# EAGLE schematic receiving end(2) (EAGLE 6.3)
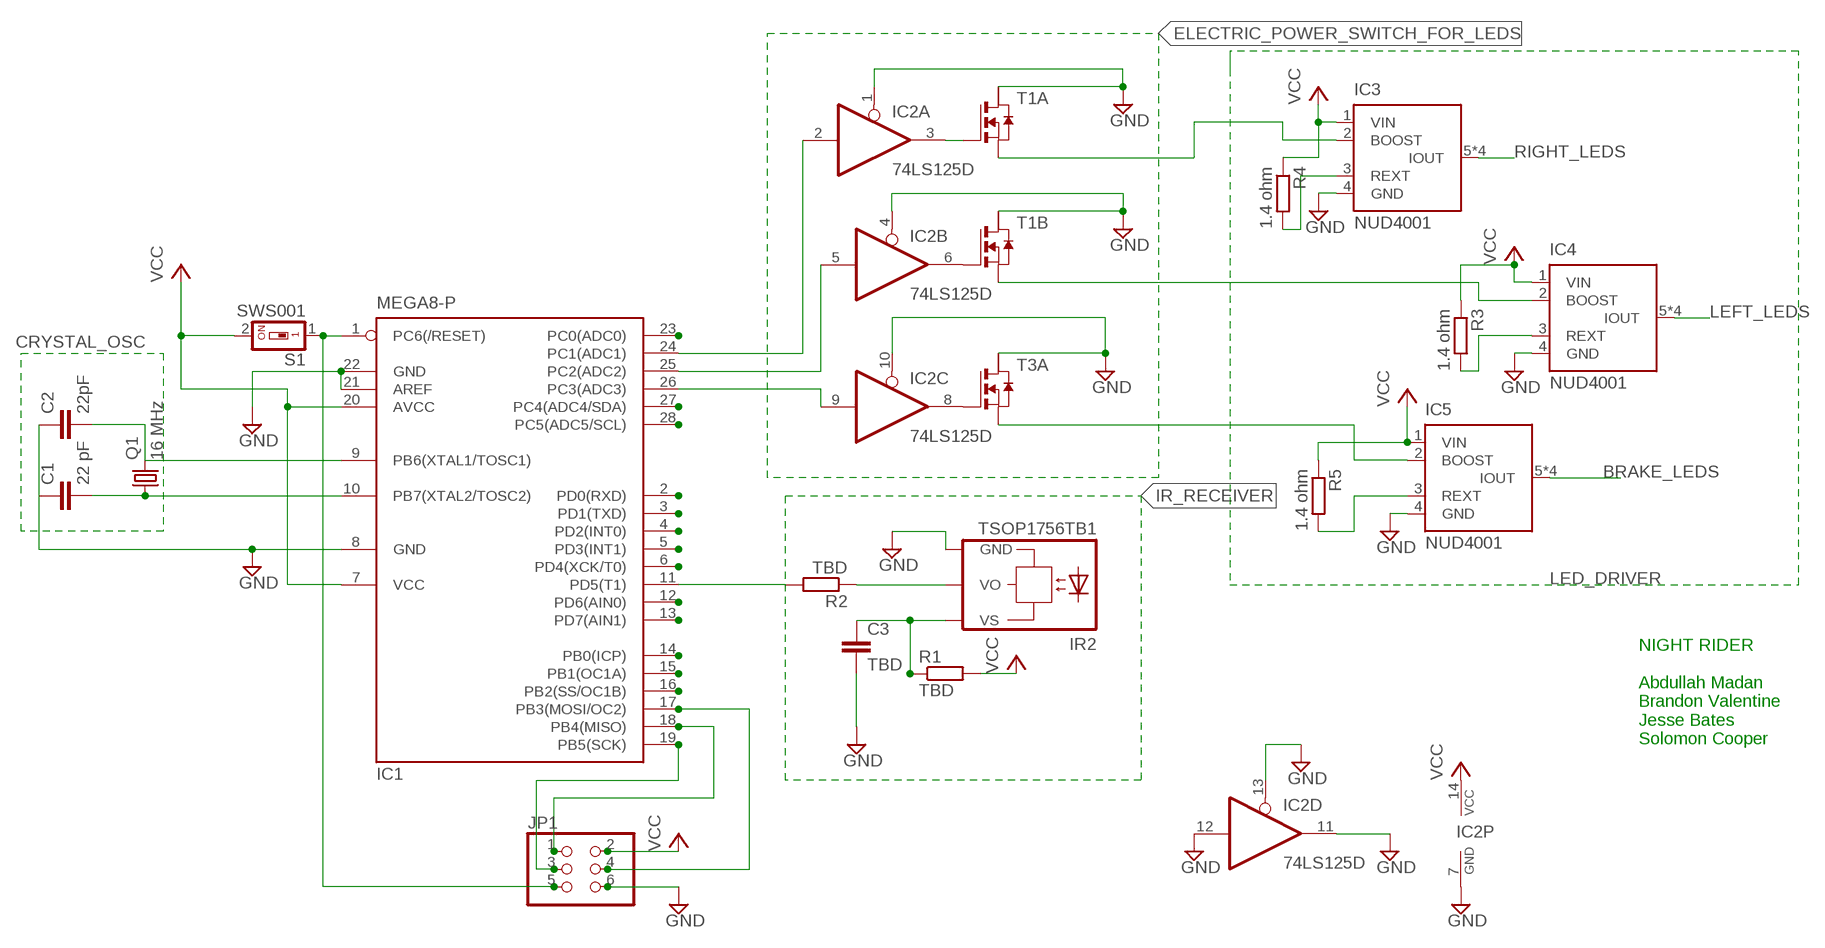
[diagram p0: schematic, sheet 1]

## Parts
C1  22 pF  C-EUC1206  [C1206]
C2  22pF  C-EUC1206  [C1206]
C3  TBD  C-EUC0805  [C0805]
IC1  MEGA8-P  [DIL28-3]
IC2  74LS125D  [SO14]
IC3  NUD4001  [SO-8]
IC4  NUD4001  [SO-8]
IC5  NUD4001  [SO-8]
IR2  TSOP1756TB1  [TSOP17_TB1]
JP1  PINHD-2X3  [2X03]
Q1  16 MHz  MC-405  [MC-405]
R1  TBD  R-EU_R0805  [R0805]
R2  TBD  R-EU_R0805  [R0805]
R3  1.4 ohm  R-EU_R0805  [R0805]
R4  1.4 ohm  R-EU_R0805  [R0805]
R5  1.4 ohm  R-EU_R0805  [R0805]
S1  SWS001  [SMS-001]
T1  NMOS2SM8  [SM8]
T3  NMOS2SM8  [SM8]

## Nets
BRAKE_LEDS: IC5.5(IOUT) IC5.6(IOUT) IC5.7(IOUT) IC5.8(IOUT)
GND: C1.1 C2.1 C3.2 IC1.8(GND) IC1.21(AREF) IC1.22(GND) IC2.1(A:OE) IC2.4(B:OE) IC2.7(P:GND) IC2.10(C:OE) IC2.11(D:O) IC2.12(D:I) IC2.13(D:OE) IC3.4(GND) IC4.4(GND) IC5.4(GND) IR2.GND JP1.6 T1.5(A:D) T1.7(B:D) T3.5(A:D)
LEFT_LEDS: IC4.5(IOUT) IC4.6(IOUT) IC4.7(IOUT) IC4.8(IOUT)
N$1: C2.2 IC1.9(PB6(XTAL1/TOSC1)) Q1.2
N$2: C1.2 IC1.10(PB7(XTAL2/TOSC2)) Q1.1
N$3: IC2.8(C:O) T3.4(A:G)
N$4: IR2.VO R2.1
N$5: IC1.11(PD5(T1)) R2.2
N$6: IC2.6(B:O) T1.2(B:G)
N$7: IC5.2(BOOST) T3.3(A:S)
N$8: IC2.3(A:O) T1.4(A:G)
N$9: IC1.26(PC3(ADC3)) IC2.9(C:I)
N$10: IC1.25(PC2(ADC2)) IC2.5(B:I)
N$11: IC1.24(PC1(ADC1)) IC2.2(A:I)
N$12: C3.1 IR2.VS R1.1
N$13: IC3.3(REXT) R4.2
N$14: IC4.2(BOOST) T1.1(B:S)
N$15: IC1.23(PC0(ADC0))
N$16: IC1.27(PC4(ADC4/SDA))
N$17: IC1.28(PC5(ADC5/SCL))
N$18: IC1.2(PD0(RXD))
N$19: IC1.3(PD1(TXD))
N$20: IC1.4(PD2(INT0))
N$21: IC1.5(PD3(INT1))
N$22: IC1.6(PD4(XCK/T0))
N$23: IC1.12(PD6(AIN0))
N$24: IC1.13(PD7(AIN1))
N$25: IC1.14(PB0(ICP))
N$26: IC1.15(PB1(OC1A))
N$27: IC1.16(PB2(SS/OC1B))
N$28: IC1.17(PB3(MOSI/OC2)) JP1.4
N$29: IC1.18(PB4(MISO)) JP1.1
N$30: IC1.19(PB5(SCK)) JP1.3
N$34: IC4.3(REXT) R3.2
N$35: IC1.1(PC6(/RESET)) JP1.5 S1.1
N$36: IC5.3(REXT) R5.2
N$37: IC3.2(BOOST) T1.3(A:S)
RIGHT_LEDS: IC3.5(IOUT) IC3.6(IOUT) IC3.7(IOUT) IC3.8(IOUT)
VCC: IC1.7(VCC) IC1.20(AVCC) IC2.14(P:VCC) IC3.1(VIN) IC4.1(VIN) IC5.1(VIN) JP1.2 R1.2 R3.1 R4.1 R5.1 S1.2
Unconnected: T1.6(A:D2) T1.8(B:D2) T3.1(B:S) T3.2(B:G) T3.6(A:D2) T3.7(B:D) T3.8(B:D2)

## Notes on the sheet
- NIGHT RIDER
  
  Abdullah Madan
  Brandon Valentine
  Jesse Bates
  Solomon Cooper

## Library data of the parts
C1-C3 = rcl:C-EU: CAPACITOR, European symbol
IC1 = atmel:MEGA8-P: MICROCONTROLLER 8 Kbytes FLASH, 1 kbytes SRAM, 512 bytes EEPROM, USART, 4-channel 10 bit ADC, 2-channel 8 bit ADC Pin compatible with Atmega48, ATMega88, ATMega168 Source: avr.lbr; OC_FARNELL: unknown; OC_NEWARK: unknown
IC2 = 74xx-eu:74*125: Quad bus BUFFER, 3-state
IC3-IC5 = led:NUD4001: High Current LED Driver Source: Data sheet <http://www.onsemi.com/pub/Collateral/NUD4001-D.PDF>
IR2 = telefunken:TSOP17*TB1: TSOP17..TB1 IR Receiver Modules for Remote Control Systems Source: http://www.vishay.com/docs/82042/82042.pdf; OC_FARNELL: unknown; OC_NEWARK: unknown
JP1 = pinhead:PINHD-2X3: PIN HEADER
Q1 = crystal:MC-405: kHz RANGE CRYSTAL UNIT SMD Source: MC-306_405_406_E07X.PDF Homepage <http://www.epsontoyocom.co.jp>; OC_FARNELL: unknown; OC_NEWARK: unknown
R1-R5 = resistor:R-EU_: RESISTOR, European symbol
S1 = smd-special:SWS001: SMD Dip Switch 1 pol.
T1 T3 = zetex:NMOS2SM8: Dual MOS FET; OC_FARNELL: unknown; OC_NEWARK: unknown